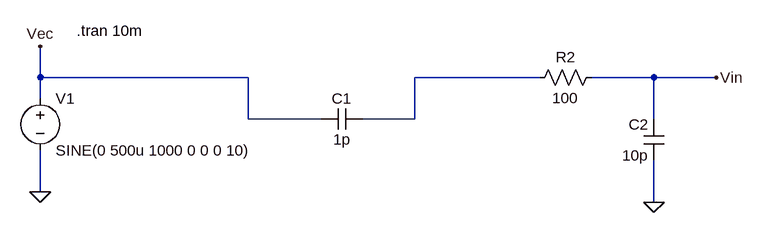
[diagram p0: schematic electrode-model.asc]
electrode-model.asc, the LTspice schematic file:
Version 4
SHEET 1 908 680
WIRE -416 160 -416 112
WIRE -96 160 -416 160
WIRE 352 160 160 160
WIRE 528 160 432 160
WIRE 624 160 528 160
WIRE -416 192 -416 160
WIRE -96 224 -96 160
WIRE 16 224 -96 224
WIRE 160 224 160 160
WIRE 160 224 80 224
WIRE 528 224 528 160
WIRE -416 336 -416 272
WIRE 528 352 528 288
FLAG 624 160 Vin
FLAG 528 352 0
FLAG -416 336 0
FLAG -416 112 Vec
SYMBOL cap 80 208 R90
WINDOW 0 0 32 VBottom 2
WINDOW 3 32 32 VTop 2
SYMATTR InstName C1
SYMATTR Value 1p
SYMBOL cap 544 288 R180
WINDOW 0 24 56 Left 2
WINDOW 3 24 8 Left 2
SYMATTR InstName C2
SYMATTR Value 10p
SYMBOL res 448 144 R90
WINDOW 0 0 56 VBottom 2
WINDOW 3 32 56 VTop 2
SYMATTR InstName R2
SYMATTR Value 100
SYMBOL voltage -416 176 R0
WINDOW 123 0 0 Left 2
WINDOW 39 0 0 Left 2
SYMATTR InstName V1
SYMATTR Value SINE(0 500u 1000 0 0 0 10)
TEXT -360 88 Left 2 !.tran 10m

The netlist it stands for:
* electrode-model.asc
C1 N001 Vec 1p
C2 0 Vin 10p
R2 Vin N001 100
V1 Vec 0 SINE(0 500u 1000 0 0 0 10)
.tran 10m
.backanno
.end